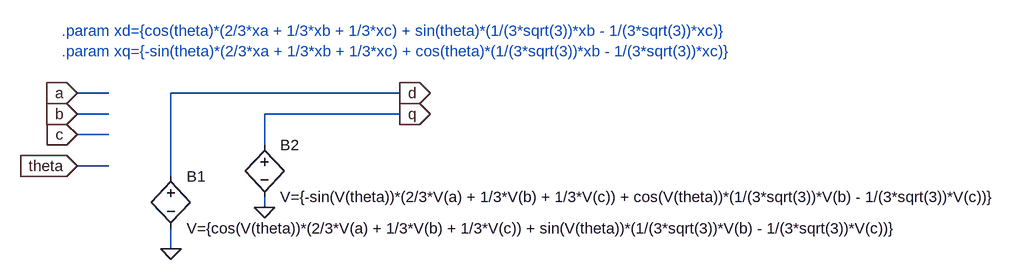
[diagram p0: schematic abctodq3.asc]
abctodq3.asc, the LTspice schematic file:
Version 4
SHEET 1 2000 680
WIRE 400 256 352 256
WIRE 848 256 496 256
WIRE 400 288 352 288
WIRE 848 288 640 288
WIRE 400 320 352 320
WIRE 640 336 640 288
WIRE 400 368 352 368
WIRE 496 384 496 256
WIRE 640 432 640 416
WIRE 496 496 496 464
FLAG 352 256 a
IOPIN 352 256 In
FLAG 352 288 b
IOPIN 352 288 In
FLAG 352 320 c
IOPIN 352 320 In
FLAG 848 256 d
IOPIN 848 256 Out
FLAG 848 288 q
IOPIN 848 288 Out
FLAG 352 368 theta
IOPIN 352 368 In
FLAG 496 496 0
FLAG 640 432 0
SYMBOL bv 496 368 R0
SYMATTR InstName B1
SYMATTR Value V={cos(V(theta))*(2/3*V(a) + 1/3*V(b) + 1/3*V(c)) + sin(V(theta))*(1/(3*sqrt(3))*V(b) - 1/(3*sqrt(3))*V(c))}
SYMBOL bv 640 320 R0
SYMATTR InstName B2
SYMATTR Value V={-sin(V(theta))*(2/3*V(a) + 1/3*V(b) + 1/3*V(c)) + cos(V(theta))*(1/(3*sqrt(3))*V(b) - 1/(3*sqrt(3))*V(c))}
TEXT 328 160 Left 2 ;.param xd={cos(theta)*(2/3*xa + 1/3*xb + 1/3*xc) + sin(theta)*(1/(3*sqrt(3))*xb - 1/(3*sqrt(3))*xc)}\n.param xq={-sin(theta)*(2/3*xa + 1/3*xb + 1/3*xc) + cos(theta)*(1/(3*sqrt(3))*xb - 1/(3*sqrt(3))*xc)}

The netlist it stands for:
* abctodq3.asc
B1 d 0 V={cos(V(theta))*(2/3*V(a) + 1/3*V(b) + 1/3*V(c)) + sin(V(theta))*(1/(3*sqrt(3))*V(b) - 1/(3*sqrt(3))*V(c))}
B2 q 0 V={-sin(V(theta))*(2/3*V(a) + 1/3*V(b) + 1/3*V(c)) + cos(V(theta))*(1/(3*sqrt(3))*V(b) - 1/(3*sqrt(3))*V(c))}
* .param xd={cos(theta)*(2/3*xa + 1/3*xb + 1/3*xc) + sin(theta)*(1/(3*sqrt(3))*xb - 1/(3*sqrt(3))*xc)}
* .param xq={-sin(theta)*(2/3*xa + 1/3*xb + 1/3*xc) + cos(theta)*(1/(3*sqrt(3))*xb - 1/(3*sqrt(3))*xc)}
.backanno
.end